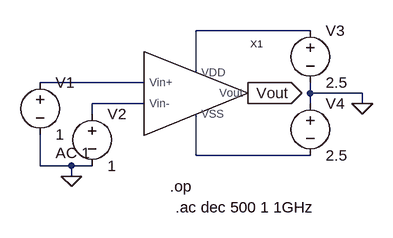
[diagram p0: schematic AC.asc]
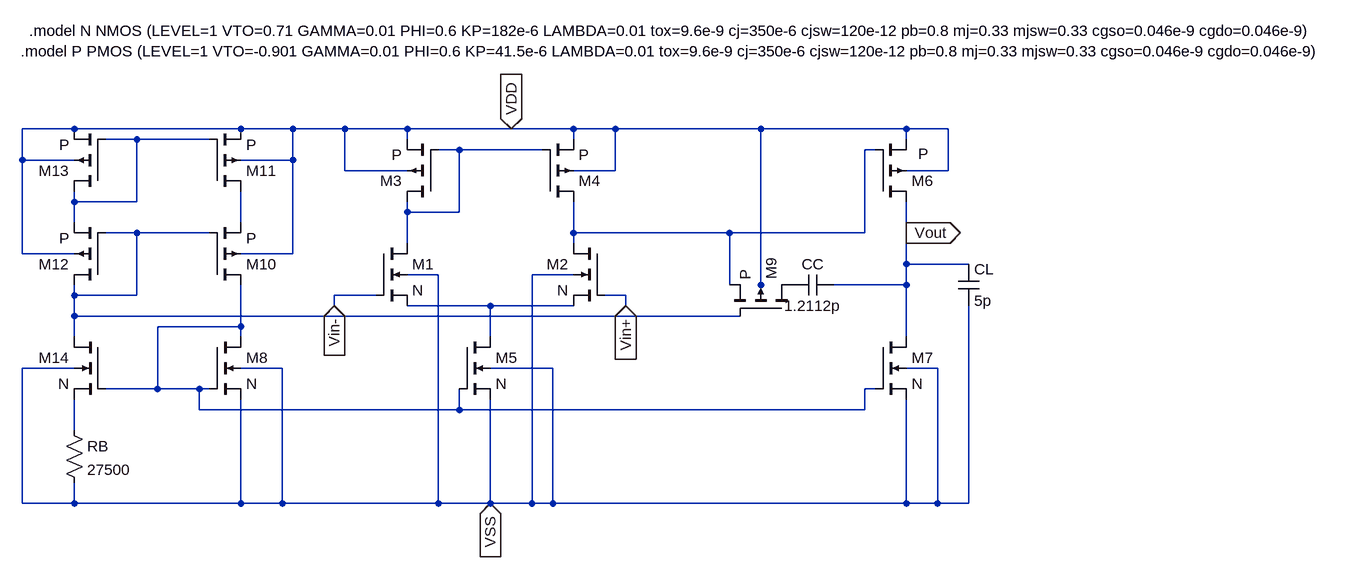
[diagram p1: sub-circuit 2opamp.asc]
AC.asc, the LTspice schematic file:
Version 4
SHEET 1 880 680
WIRE 352 64 176 64
WIRE 176 128 176 64
WIRE 96 144 -64 144
WIRE 352 160 352 144
WIRE 432 160 352 160
WIRE 96 176 16 176
WIRE 352 176 352 160
WIRE 432 176 432 160
WIRE 16 192 16 176
WIRE 176 256 176 192
WIRE 352 256 176 256
WIRE -64 272 -64 224
WIRE -16 272 -64 272
WIRE 16 272 -16 272
WIRE -16 288 -16 272
FLAG 256 160 Vout
IOPIN 256 160 Out
FLAG -16 288 0
FLAG 432 176 0
SYMBOL 2OPAMP 176 160 R0
SYMATTR InstName X1
SYMBOL voltage -64 128 R0
WINDOW 123 24 124 Left 2
WINDOW 39 0 0 Left 2
SYMATTR Value2 AC 1
SYMATTR InstName V1
SYMATTR Value 1
SYMBOL voltage 16 176 R0
WINDOW 123 0 0 Left 2
WINDOW 39 0 0 Left 2
SYMATTR InstName V2
SYMATTR Value 1
SYMBOL voltage 352 48 R0
WINDOW 123 0 0 Left 2
WINDOW 39 0 0 Left 2
SYMATTR InstName V3
SYMATTR Value 2.5
SYMBOL voltage 352 160 R0
WINDOW 123 0 0 Left 2
WINDOW 39 0 0 Left 2
SYMATTR InstName V4
SYMATTR Value 2.5
TEXT 136 304 Left 2 !.op
TEXT 144 336 Left 2 !.ac dec 500 1 1GHz

2opamp.asc, the sub-circuit schematic file:
Version 4
SHEET 1 1256 680
WIRE -880 -464 -960 -464
WIRE -624 -464 -880 -464
WIRE -544 -464 -624 -464
WIRE -464 -464 -544 -464
WIRE -368 -464 -464 -464
WIRE -208 -464 -368 -464
WIRE -112 -464 -208 -464
WIRE -48 -464 -112 -464
WIRE 176 -464 -48 -464
WIRE 400 -464 176 -464
WIRE 464 -464 400 -464
WIRE -784 -448 -832 -448
WIRE -672 -448 -784 -448
WIRE -368 -448 -368 -464
WIRE -112 -448 -112 -464
WIRE 400 -448 400 -464
WIRE -288 -432 -320 -432
WIRE -160 -432 -288 -432
WIRE 352 -432 336 -432
WIRE -960 -416 -960 -464
WIRE -880 -416 -960 -416
WIRE -544 -416 -544 -464
WIRE -544 -416 -624 -416
WIRE -464 -400 -464 -464
WIRE -368 -400 -464 -400
WIRE -48 -400 -48 -464
WIRE -48 -400 -112 -400
WIRE 464 -400 464 -464
WIRE 464 -400 400 -400
WIRE -880 -352 -880 -368
WIRE -784 -352 -784 -448
WIRE -784 -352 -880 -352
WIRE -368 -336 -368 -352
WIRE -288 -336 -288 -432
WIRE -288 -336 -368 -336
WIRE -880 -320 -880 -352
WIRE -624 -320 -624 -368
WIRE -784 -304 -832 -304
WIRE -672 -304 -784 -304
WIRE -112 -304 -112 -352
WIRE 128 -304 -112 -304
WIRE 336 -304 336 -432
WIRE 336 -304 128 -304
WIRE 400 -304 400 -352
WIRE -368 -288 -368 -336
WIRE -112 -288 -112 -304
WIRE -960 -272 -960 -416
WIRE -880 -272 -960 -272
WIRE -544 -272 -544 -416
WIRE -544 -272 -624 -272
WIRE 400 -256 400 -304
WIRE 496 -256 400 -256
WIRE -320 -240 -368 -240
WIRE -112 -240 -176 -240
WIRE 128 -224 128 -304
WIRE 176 -224 176 -464
WIRE 400 -224 400 -256
WIRE 400 -224 288 -224
WIRE -880 -208 -880 -224
WIRE -784 -208 -784 -304
WIRE -784 -208 -880 -208
WIRE -416 -208 -480 -208
WIRE -32 -208 -64 -208
WIRE 176 -208 176 -224
WIRE -480 -192 -480 -208
WIRE -240 -192 -368 -192
WIRE -112 -192 -240 -192
WIRE -32 -192 -32 -208
WIRE -880 -176 -880 -208
WIRE 144 -176 -880 -176
WIRE -624 -160 -624 -224
WIRE -624 -160 -752 -160
WIRE -880 -144 -880 -176
WIRE -624 -144 -624 -160
WIRE -240 -144 -240 -192
WIRE 400 -144 400 -224
WIRE -880 -96 -960 -96
WIRE -560 -96 -624 -96
WIRE -144 -96 -240 -96
WIRE 448 -96 400 -96
WIRE -752 -64 -752 -160
WIRE -752 -64 -832 -64
WIRE -688 -64 -752 -64
WIRE -672 -64 -688 -64
WIRE 352 -64 336 -64
WIRE -688 -32 -688 -64
WIRE -288 -32 -288 -64
WIRE -288 -32 -688 -32
WIRE 336 -32 336 -64
WIRE 336 -32 -288 -32
WIRE -880 0 -880 -48
WIRE -960 112 -960 -96
WIRE -880 112 -880 80
WIRE -880 112 -960 112
WIRE -624 112 -624 -48
WIRE -624 112 -880 112
WIRE -560 112 -560 -96
WIRE -560 112 -624 112
WIRE -320 112 -320 -240
WIRE -320 112 -560 112
WIRE -240 112 -240 -48
WIRE -240 112 -320 112
WIRE -176 112 -176 -240
WIRE -176 112 -240 112
WIRE -144 112 -144 -96
WIRE -144 112 -176 112
WIRE 400 112 400 -48
WIRE 400 112 -144 112
WIRE 448 112 448 -96
WIRE 448 112 400 112
WIRE 496 112 496 -192
WIRE 496 112 448 112
FLAG -32 -192 Vin+
IOPIN -32 -192 In
FLAG -480 -192 Vin-
IOPIN -480 -192 In
FLAG -240 112 VSS
IOPIN -240 112 In
FLAG 400 -304 Vout
IOPIN 400 -304 Out
FLAG -208 -464 VDD
IOPIN -208 -464 In
SYMBOL nmos4 -416 -288 R0
SYMATTR InstName M1
SYMATTR Value N
SYMATTR Value2 l=1u w=1.5583u
SYMBOL nmos4 -64 -288 M0
SYMATTR InstName M2
SYMATTR Value N
SYMATTR Value2 l=1u w=1.5583u
SYMBOL pmos4 -320 -352 R180
SYMATTR InstName M3
SYMATTR Value P
SYMATTR Value2 l=1u w=1.6538u
SYMBOL pmos4 -160 -352 M180
SYMATTR InstName M4
SYMATTR Value P
SYMATTR Value2 l=1u w=1.6538u
SYMBOL nmos4 -288 -144 R0
SYMATTR InstName M5
SYMATTR Value N
SYMATTR Value2 l=1u w=0.5789u
SYMBOL pmos4 352 -352 M180
WINDOW 3 66 74 Left 2
SYMATTR Value P
SYMATTR InstName M6
SYMATTR Value2 l=4.1110u w=69.7329u
SYMBOL nmos4 352 -144 R0
SYMATTR InstName M7
SYMATTR Value N
SYMATTR Value2 l=1u w=2.9688u
SYMBOL nmos4 -672 -144 R0
SYMATTR InstName M8
SYMATTR Value N
SYMATTR Value2 l=1u w=0.5789u
SYMBOL pmos4 224 -176 M270
SYMATTR InstName M9
SYMATTR Value P
SYMATTR Value2 l=1u w=3.3077u
SYMBOL cap 224 -208 R270
WINDOW 0 32 32 VTop 2
WINDOW 3 0 32 VBottom 2
SYMATTR InstName CC
SYMATTR Value 1.2112p
SYMBOL pmos4 -672 -224 M180
SYMATTR InstName M10
SYMATTR Value P
SYMATTR Value2 l=1u w=3.3077u
SYMBOL pmos4 -672 -368 M180
SYMATTR InstName M11
SYMATTR Value P
SYMATTR Value2 l=1u w=3.3077u
SYMBOL pmos4 -832 -224 R180
SYMATTR InstName M12
SYMATTR Value P
SYMATTR Value2 l=1u w=3.3077u
SYMBOL pmos4 -832 -368 R180
SYMATTR InstName M13
SYMATTR Value P
SYMATTR Value2 l=1u w=3.3077u
SYMBOL nmos4 -832 -144 M0
SYMATTR InstName M14
SYMATTR Value N
SYMATTR Value2 l=1u w=2.3157u
SYMBOL res -896 -16 R0
SYMATTR InstName RB
SYMATTR Value 27500
SYMBOL cap 480 -256 R0
SYMATTR InstName CL
SYMATTR Value 5p
TEXT 48 -568 Bottom 2 !.model N NMOS (LEVEL=1 VTO=0.71 GAMMA=0.01 PHI=0.6 KP=182e-6 LAMBDA=0.01 tox=9.6e-9 cj=350e-6 cjsw=120e-12 pb=0.8 mj=0.33 mjsw=0.33 cgso=0.046e-9 cgdo=0.046e-9)\n.model P PMOS (LEVEL=1 VTO=-0.901 GAMMA=0.01 PHI=0.6 KP=41.5e-6 LAMBDA=0.01 tox=9.6e-9 cj=350e-6 cjsw=120e-12 pb=0.8 mj=0.33 mjsw=0.33 cgso=0.046e-9 cgdo=0.046e-9)

The netlist it stands for:
* AC.asc
XX1 N001 N002 N003 N004 Vout 2opamp
V1 N002 0 1 AC 1
V2 N003 0 1
V3 N001 0 2.5
V4 0 N004 2.5

* block symbol definitions
.subckt 2opamp VDD Vin+ Vin- VSS Vout
M1 N002 Vin- N006 VSS N l=1u w=1.5583u
M2 N003 Vin+ N006 VSS N l=1u w=1.5583u
M3 N002 N002 VDD VDD P l=1u w=1.6538u
M4 N003 N002 VDD VDD P l=1u w=1.6538u
M5 N006 N007 VSS VSS N l=1u w=0.5789u
M6 Vout N003 VDD VDD P l=4.1110u w=69.7329u
M7 Vout N007 VSS VSS N l=1u w=2.9688u
M8 N007 N007 VSS VSS N l=1u w=0.5789u
M9 P001 N005 N003 VDD P l=1u w=3.3077u
CC P001 Vout 1.2112p
M10 N007 N005 N004 VDD P l=1u w=3.3077u
M11 N004 N001 VDD VDD P l=1u w=3.3077u
M12 N005 N005 N001 VDD P l=1u w=3.3077u
M13 N001 N001 VDD VDD P l=1u w=3.3077u
M14 N005 N007 N008 VSS N l=1u w=2.3157u
RB N008 VSS 27500
CL Vout VSS 5p
.model N NMOS (LEVEL=1 VTO=0.71 GAMMA=0.01 PHI=0.6 KP=182e-6 LAMBDA=0.01 tox=9.6e-9 cj=350e-6 cjsw=120e-12 pb=0.8 mj=0.33 mjsw=0.33 cgso=0.046e-9 cgdo=0.046e-9)
.model P PMOS (LEVEL=1 VTO=-0.901 GAMMA=0.01 PHI=0.6 KP=41.5e-6 LAMBDA=0.01 tox=9.6e-9 cj=350e-6 cjsw=120e-12 pb=0.8 mj=0.33 mjsw=0.33 cgso=0.046e-9 cgdo=0.046e-9)
.ends 2opamp

.model NMOS NMOS
.model PMOS PMOS
.lib standard.mos
.op
.ac dec 500 1 1GHz
.backanno
.end